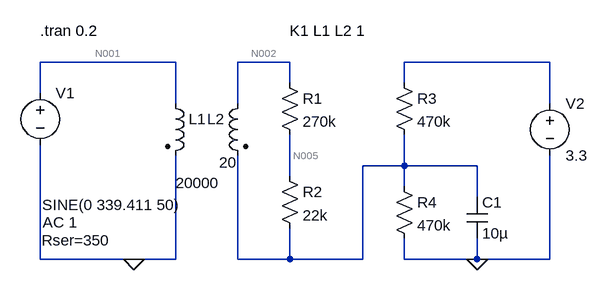
[diagram p0: schematic FYP VT.asc]
FYP VT.asc, the LTspice schematic file:
Version 4
SHEET 1 880 680
WIRE 240 112 32 112
WIRE 416 112 336 112
WIRE 816 112 592 112
WIRE 416 144 416 112
WIRE 592 144 592 112
WIRE 32 160 32 112
WIRE 240 176 240 112
WIRE 336 176 336 112
WIRE 816 176 816 112
WIRE 592 272 592 224
WIRE 592 272 528 272
WIRE 704 272 592 272
WIRE 416 288 416 224
WIRE 592 304 592 272
WIRE 704 320 704 272
WIRE 32 416 32 240
WIRE 176 416 32 416
WIRE 240 416 240 256
WIRE 240 416 176 416
WIRE 336 416 336 256
WIRE 416 416 416 368
WIRE 416 416 336 416
WIRE 528 416 528 272
WIRE 528 416 416 416
WIRE 592 416 592 384
WIRE 704 416 704 384
WIRE 704 416 592 416
WIRE 816 416 816 256
WIRE 816 416 704 416
FLAG 704 416 0
FLAG 176 416 0
SYMBOL voltage 32 144 R0
WINDOW 123 4 215 Left 2
WINDOW 39 2 243 Left 2
WINDOW 3 3 188 Left 2
SYMATTR Value2 AC 1
SYMATTR SpiceLine Rser=350
SYMATTR InstName V1
SYMATTR Value SINE(0 339.411 50)
SYMBOL res 400 128 R0
SYMATTR InstName R1
SYMATTR Value 270k
SYMBOL res 400 272 R0
SYMATTR InstName R2
SYMATTR Value 22k
SYMBOL res 576 128 R0
SYMATTR InstName R3
SYMATTR Value 470k
SYMBOL res 576 288 R0
SYMATTR InstName R4
SYMATTR Value 470k
SYMBOL cap 688 320 R0
SYMATTR InstName C1
SYMATTR Value 10µ
SYMBOL voltage 816 160 R0
WINDOW 123 0 0 Left 2
WINDOW 39 0 0 Left 2
SYMATTR InstName V2
SYMATTR Value 3.3
SYMBOL ind2 224 160 R0
WINDOW 3 16 138 Left 2
SYMATTR Value 20000
SYMATTR InstName L1
SYMATTR Type ind
SYMBOL ind2 352 160 M0
WINDOW 3 18 107 Left 2
SYMATTR Value 20
SYMATTR InstName L2
SYMATTR Type ind
TEXT 32 64 Left 2 !.tran 0.2
TEXT 416 64 Left 2 !K1 L1 L2 1

The netlist it stands for:
* FYP VT.asc
V1 N001 0 SINE(0 339.411 50) AC 1 Rser=350
R1 N002 N005 270k
R2 N005 N004 22k
R3 N003 N004 470k
R4 N004 0 470k
C1 N004 0 10µ
V2 N003 0 3.3
L1 N001 0 20000
L2 N002 N004 20
.tran 0.2
K1 L1 L2 1
.backanno
.end

* Results of the author's LTspice run, read from the files saved beside the schematic
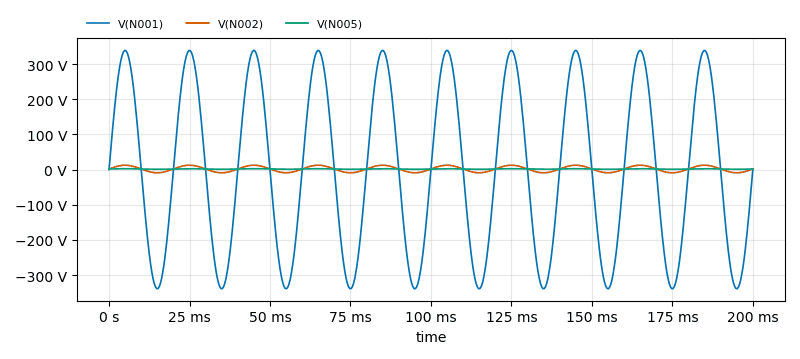
[diagram p1: Transient Analysis of FYP VT.asc, plotted from the saved traces]
* Transient Analysis, 1 run:
*   V(N001): min -339 V, max 339 V, average -32.59 mV, rms 239.7 V, last 66.03 µV
*   V(N002): min -9.07 V, max 12.37 V, average 1.649 V, rms 7.757 V, last 1.65 V
*   V(N005): min 842.3 mV, max 2.458 V, average 1.65 V, rms 1.746 V, last 1.65 V